# EAGLE design ACESMorlandBargraphV4 (EAGLE 9.4.2)
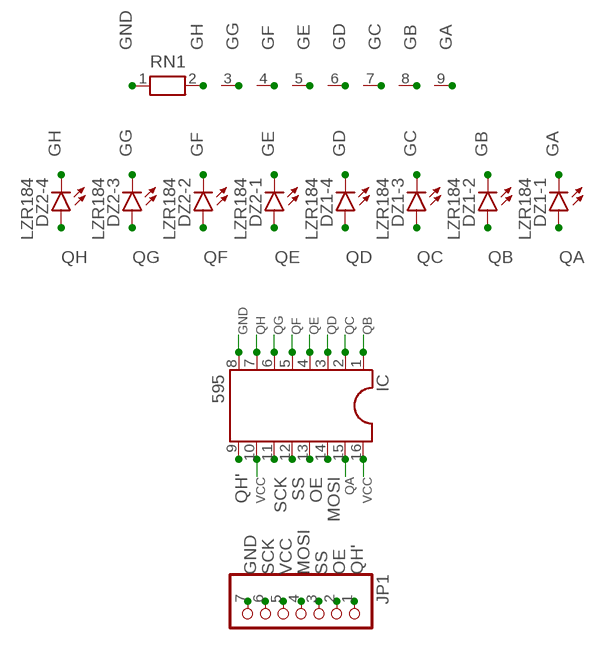
[diagram p0: schematic, sheet 1]

## Parts
DZ1  LZR184  [LZR184]
DZ2  LZR184  [LZR184]
IC  595  DIL16  [DIL16]
JP1  PINHD-1X7/90  [1X07/90]
RN1  RN08  [RN-9]

## Nets
GA: DZ1.K1(-1:C) RN1.9
GB: DZ1.K2(-2:C) RN1.8
GC: DZ1.K3(-3:C) RN1.7
GD: DZ1.K4(-4:C) RN1.6
GE: DZ2.K1(-1:C) RN1.5
GF: DZ2.K2(-2:C) RN1.4
GG: DZ2.K3(-3:C) RN1.3
GH: DZ2.K4(-4:C) RN1.2
GND: IC.8 JP1.7 RN1.1
MOSI: IC.14 JP1.4
OE: IC.13 JP1.2
QA: DZ1.A1(-1:A) IC.15
QB: DZ1.A2(-2:A) IC.1
QC: DZ1.A3(-3:A) IC.2
QD: DZ1.A4(-4:A) IC.3
QE: DZ2.A1(-1:A) IC.4
QF: DZ2.A2(-2:A) IC.5
QG: DZ2.A3(-3:A) IC.6
QH: DZ2.A4(-4:A) IC.7
QH': IC.9 JP1.1
SCK: IC.11 JP1.6
SS: IC.12 JP1.3
VCC: IC.10 IC.16 JP1.5

## Library data of the parts
DZ1 DZ2 = led:LZR184: LED BLOCK 4 LEDs, Siemens
IC = ic-package:DIL16: Dual In Line / Socket
JP1 = pinhead:PINHD-1X7: PIN HEADER
RN1 = resistor-net:RN08: RESISTOR NETWORK; OC_FARNELL: unknown; OC_NEWARK: unknown

## Board
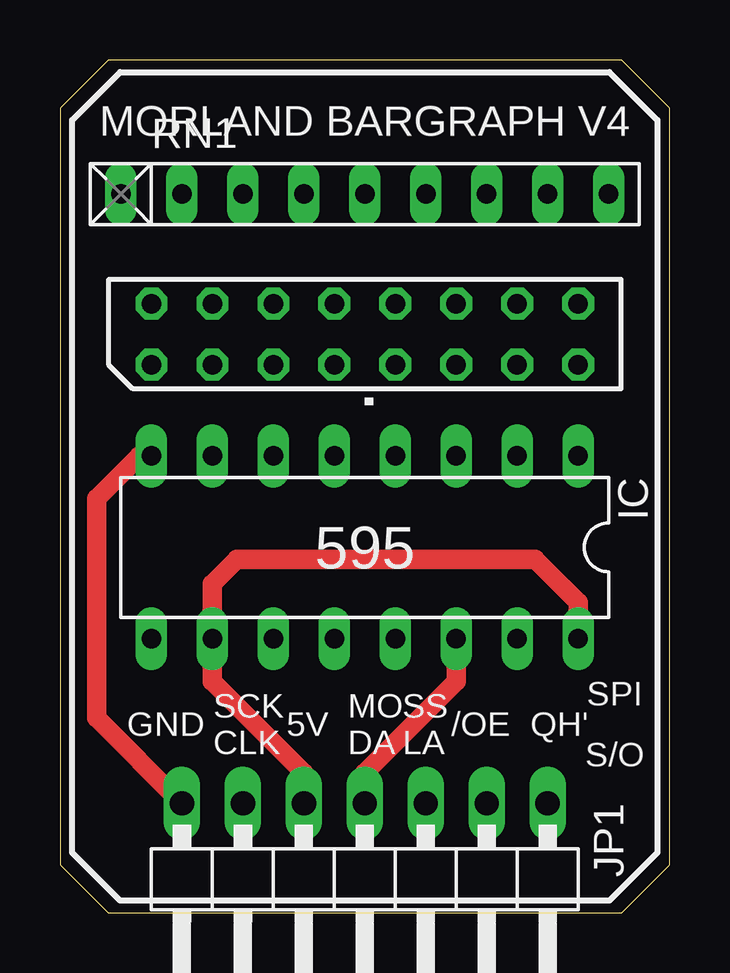
[diagram p1: board, top side]
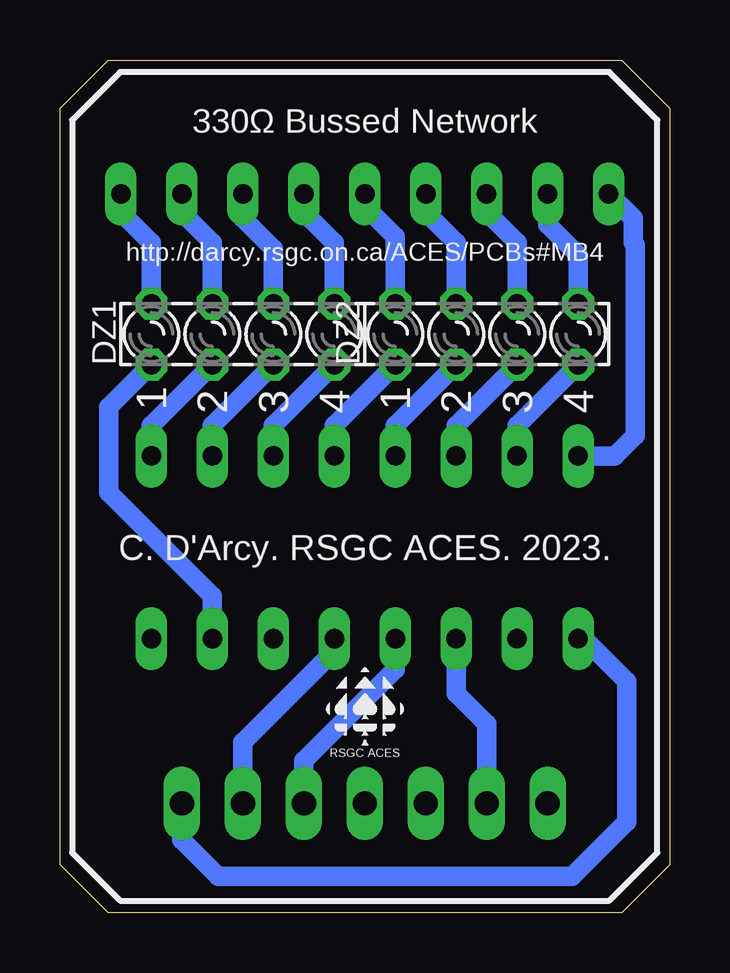
[diagram p2: board, bottom side, seen from below]

Size 25.4 x 35.56 mm. Coordinates in mm from the lower left corner, seen from the top.
Outline: 25.4,2 25.4,33.56 23.4,35.56 2,35.56 0,33.56 0,2 2,0 23.4,0 25.4,2
Copper layers (1*16): Top 0.035mm / dielectric 1.5mm / Bottom 0.035mm
Design rules "ACES_THT": minimum track width 20mil, minimum drill 0.35mm, track to track 6mil, track to pad 6mil, pad to pad 6mil, via to via 6mil, smd to smd 6mil, copper to edge 40mil, drill to drill 6mil, minimum pad ring 10mil, minimum via ring 8mil, stop-mask expansion 4mil, vias tented up to drill 0mil, thermal gap 10mil

### Footprints (pad centres in the part's own frame; a part is rotated, then mirrored left to right if it is on the bottom)
LZR184 = drill 0.813 octagon: A1 -1.27,3.81; A2 -1.27,1.27; A3 -1.27,-1.27; A4 -1.27,-3.81; K1 1.27,3.81; K2 1.27,1.27; K3 1.27,-1.27; K4 1.27,-3.81
DIL16 = drill 0.813 long: 1 -8.89,-3.81; 2 -6.35,-3.81; 3 -3.81,-3.81; 4 -1.27,-3.81; 5 1.27,-3.81; 6 3.81,-3.81; 7 6.35,-3.81; 8 8.89,-3.81; 9 8.89,3.81; 10 6.35,3.81; 11 3.81,3.81; 12 1.27,3.81; 13 -1.27,3.81; 14 -3.81,3.81; 15 -6.35,3.81; 16 -8.89,3.81
1X07/90 = drill 1.016 long: 1 -7.62,-3.81; 2 -5.08,-3.81; 3 -2.54,-3.81; 4 0,-3.81; 5 2.54,-3.81; 6 5.08,-3.81; 7 7.62,-3.81
RN-9 = drill 0.813 long: 1 -10.16,0; 2 -7.62,0; 3 -5.08,0; 4 -2.54,0; 5 0,0; 6 2.54,0; 7 5.08,0; 8 7.62,0; 9 10.16,0

### Placement (x,y rotation side)
DZ1  17.78,24.13 90 bottom
DZ2  7.62,24.13 90 bottom
IC  12.7,15.24 180 top
JP1  12.7,0.76 180 top
RN1  12.7,29.97 0 top
U$1  [SMALL_BSILK_TEXT]  12.7,8.64 0 top

### Tracks (layer width: path | path; a pad name or v marks a point on that pad's centre or on a via)
GA
  Bottom 0.813: RN1.9 22.86,29.21 21.59,27.94 DZ1.K1
GB
  Bottom 0.813: RN1.8 20.32,29.21 19.05,27.94 DZ1.K2
GC
  Bottom 0.813: RN1.7 17.78,28.96 16.51,27.69 DZ1.K3
GD
  Bottom 0.813: RN1.6 15.24,29.21 13.97,27.94 DZ1.K4
GE
  Bottom 0.813: RN1.5 12.7,29.46 11.43,28.19 DZ2.K1
GF
  Bottom 0.813: RN1.4 10.16,29.21 8.89,27.94 DZ2.K2
GG
  Bottom 0.813: RN1.3 7.62,29.21 6.35,27.94 DZ2.K3
GH
  Bottom 0.813: RN1.2 5.08,28.7 3.81,27.43 DZ2.K4
GND
  Top 0.813: IC.8 3.3,19.05 1.52,17.27 1.52,8.13 JP1.7
  Bottom 0.813: IC.8 2.29,19.05 1.42,19.91 1.42,27.84 1.52,27.94 1.52,28.96 RN1.1
MOSI
  Top 0.813: JP1.4 12.7,5.84 16.51,9.65 IC.14
OE
  Bottom 0.813: IC.13 13.97,10.92 17.78,7.11 JP1.2
QA
  Bottom 0.813: IC.15 19.05,13.21 23.37,17.53 23.37,21.08 DZ1.A1
QB
  Bottom 0.813: IC.1 21.59,20.32 DZ1.A2
QC
  Bottom 0.813: IC.2 19.05,20.32 DZ1.A3
QD
  Bottom 0.813: IC.3 16.51,20.32 DZ1.A4
QE
  Bottom 0.813: IC.4 13.97,20.32 DZ2.A1
QF
  Bottom 0.813: IC.5 11.43,20.32 DZ2.A2
QG
  Bottom 0.813: IC.6 8.89,20.32 DZ2.A3
QH
  Bottom 0.813: IC.7 6.35,20.32 DZ2.A4
QH'
  Bottom 0.813: JP1.1 20.32,3.05 18.8,1.52 4.06,1.52 1.78,3.81 1.78,9.65 3.56,11.43 IC.9
SCK
  Bottom 0.813: JP1.6 7.62,7.87 8.89,9.14 IC.11
SS
  Bottom 0.813: JP1.3 15.24,6.35 11.43,10.16 IC.12
VCC
  Top 0.813: JP1.5 10.16,5.84 6.35,9.65 IC.10 6.35,13.72 7.37,14.73 19.81,14.73 21.59,12.95 IC.16

### Text on the board
tSilk: MORLAND BARGRAPH V4 | . | 595 | SPI | SCK | MO | SS | GND | CLK | 5V | DA | LA | /OE | QH' | S/O
bSilk: 330Ω Bussed Network | http://darcy.rsgc.on.ca/ACES/PCBs#MB4 | C. D'Arcy. RSGC ACES. 2023.